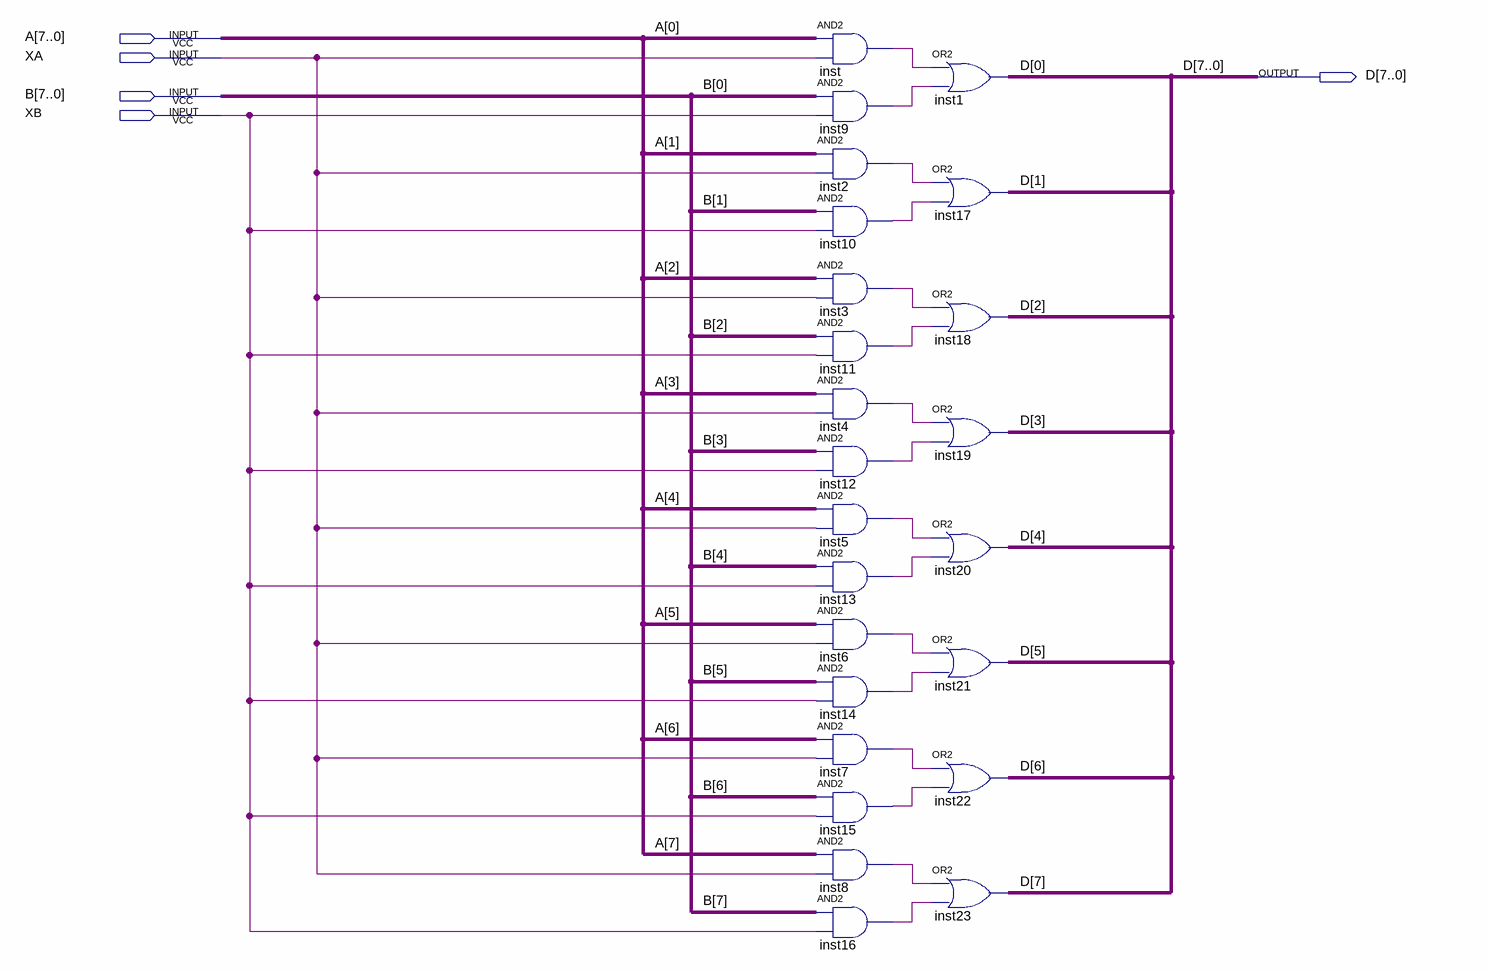
[diagram p0: schematic sheet]
// Quartus schematic SEL2.bdf as structural Verilog: 24 symbols, 5 pins
module SEL2 (
  input  [7:0] A,
  input  XA,
  input  [7:0] B,
  input  XB,
  output [7:0] D
);

  wire inst2_out, inst3_out, inst4_out, inst5_out, inst6_out, inst7_out, inst8_out, inst9_out, inst10_out,
       inst11_out, inst12_out, inst13_out, inst14_out, inst15_out, inst16_out, inst_out;

  and inst (inst_out, A[0], XA);
  and inst9 (inst9_out, B[0], XB);
  and inst2 (inst2_out, A[1], XA);
  and inst10 (inst10_out, B[1], XB);
  and inst3 (inst3_out, A[2], XA);
  and inst11 (inst11_out, B[2], XB);
  and inst4 (inst4_out, A[3], XA);
  and inst12 (inst12_out, B[3], XB);
  and inst5 (inst5_out, A[4], XA);
  and inst13 (inst13_out, B[4], XB);
  and inst6 (inst6_out, A[5], XA);
  and inst14 (inst14_out, B[5], XB);
  and inst7 (inst7_out, A[6], XA);
  and inst15 (inst15_out, B[6], XB);
  and inst8 (inst8_out, A[7], XA);
  and inst16 (inst16_out, B[7], XB);
  or inst1 (D[0], inst_out, inst9_out);
  or inst17 (D[1], inst2_out, inst10_out);
  or inst18 (D[2], inst3_out, inst11_out);
  or inst19 (D[3], inst4_out, inst12_out);
  or inst20 (D[4], inst5_out, inst13_out);
  or inst21 (D[5], inst6_out, inst14_out);
  or inst22 (D[6], inst7_out, inst15_out);
  or inst23 (D[7], inst8_out, inst16_out);
endmodule
